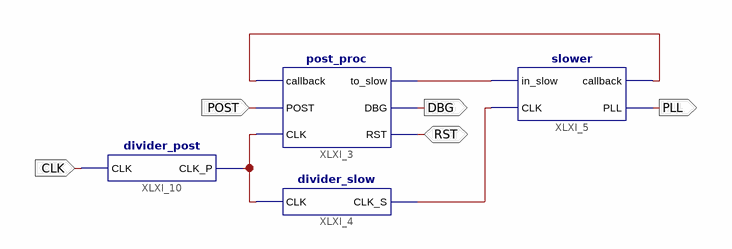
[diagram p0: schematic sheet 1]
// Xilinx ISE schematic overall.sch (xbr) as structural Verilog: 4 symbols, 5 ports
module overall (
  input  POST,
  input  CLK,
  inout  RST,
  output PLL,
  output DBG
);

  wire XLXN_6, XLXN_7, XLXN_11, XLXN_15;

  post_proc XLXI_3 (.CLK(XLXN_15), .to_slow(XLXN_6), .DBG(DBG), .RST(RST), .POST(POST), .callback(XLXN_11));
  divider_slow XLXI_4 (.CLK(XLXN_15), .CLK_S(XLXN_7));
  slower XLXI_5 (.CLK(XLXN_7), .in_slow(XLXN_6), .PLL(PLL), .callback(XLXN_11));
  divider_post XLXI_10 (.CLK(CLK), .CLK_P(XLXN_15));
endmodule
